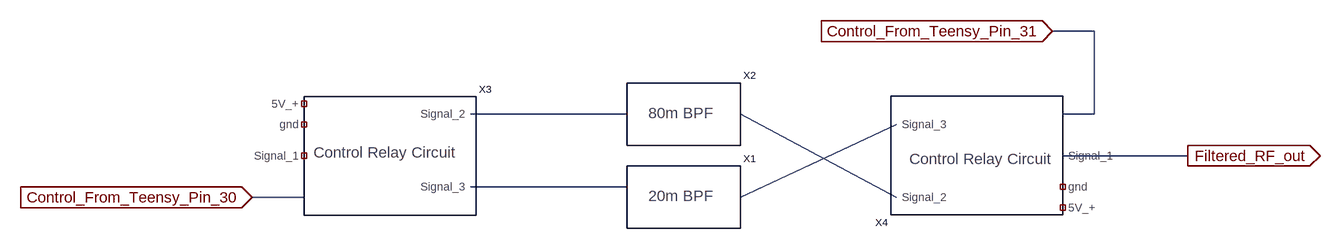
[diagram p0: schematic 80m_20m BPFs.asc]
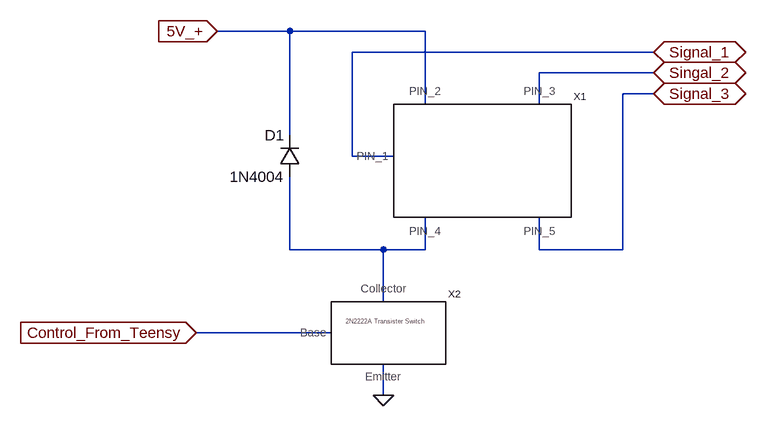
[diagram p1: sub-circuit relay_with_control.asc]
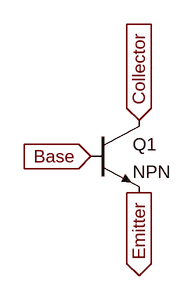
[diagram p2: sub-circuit transistor_switch_(poweramp_for_teensy_to_relay).asc]
80m_20m BPFs.asc, the LTspice schematic file:
Version 4
SHEET 1 1088 680
WIRE 704 -32 640 -32
WIRE -16 96 -256 96
WIRE 704 96 704 -32
WIRE 704 96 656 96
WIRE 848 160 656 160
WIRE -16 208 -256 208
WIRE -512 224 -592 224
WIRE 160 224 400 112
WIRE 400 224 160 96
FLAG -592 224 Control_From_Teensy_Pin_30
IOPIN -592 224 In
FLAG 848 160 Filtered_RF_out
IOPIN 848 160 Out
FLAG 640 -32 Control_From_Teensy_Pin_31
IOPIN 640 -32 In
SYMBOL Final\ SDR\ schematics\ for\ SDD\ 4_28_19\\20m\ BP 112 240 R0
SYMATTR InstName X1
SYMBOL Final\ SDR\ schematics\ for\ SDD\ 4_28_19\\80m\ BP 112 112 R0
SYMATTR InstName X2
SYMBOL Final\ SDR\ schematics\ for\ SDD\ 4_28_19\\Relay_With_Control -368 160 R0
SYMATTR InstName X3
SYMBOL Final\ SDR\ schematics\ for\ SDD\ 4_28_19\\Relay_With_Control 512 160 R180
SYMATTR InstName X4

relay_with_control.asc, the sub-circuit schematic file:
Version 4
SHEET 1 880 680
WIRE -64 -16 -176 -16
WIRE 144 -16 -64 -16
WIRE 496 16 32 16
WIRE 496 48 320 48
WIRE 496 80 448 80
WIRE 144 96 144 -16
WIRE 320 96 320 48
WIRE -64 144 -64 -16
WIRE 32 176 32 16
WIRE 96 176 32 176
WIRE -64 320 -64 208
WIRE 80 320 -64 320
WIRE 144 320 144 272
WIRE 144 320 80 320
WIRE 320 320 320 272
WIRE 448 320 448 80
WIRE 448 320 320 320
WIRE 80 400 80 320
WIRE 0 448 -208 448
WIRE 80 544 80 496
FLAG -176 -16 5V_+
IOPIN -176 -16 In
FLAG -208 448 Control_From_Teensy
IOPIN -208 448 In
FLAG 496 16 Signal_1
IOPIN 496 16 BiDir
FLAG 496 48 Singal_2
IOPIN 496 48 BiDir
FLAG 496 80 Signal_3
IOPIN 496 80 BiDir
FLAG 80 544 0
SYMBOL Relay 272 224 R0
SYMATTR InstName X1
SYMBOL Transistor_switch_(powerAMP_for_Teensy_to_relay) 64 448 R0
SYMATTR InstName X2
SYMBOL diode -48 208 R180
WINDOW 0 24 64 Left 2
WINDOW 3 24 0 Left 2
SYMATTR InstName D1
SYMATTR Value 1N4004

transistor_switch_(poweramp_for_teensy_to_relay).asc, the sub-circuit schematic file:
Version 4
SHEET 1 880 680
FLAG 128 144 Base
IOPIN 128 144 In
FLAG 192 192 Emitter
IOPIN 192 192 Out
FLAG 192 96 Collector
IOPIN 192 96 In
SYMBOL npn 128 96 R0
SYMATTR InstName Q1

The netlist it stands for:
* 80m_20m BPFs.asc
XX1 20m BP
XX2 80m BP
XX3 NC_01 NC_02 Control_From_Teensy_Pin_30 NC_03 N001 N002 relay_with_control
XX4 NC_04 NC_05 Control_From_Teensy_Pin_31 Filtered_RF_out N004 N003 relay_with_control

* block symbol definitions
.subckt relay_with_control 5V_+ gnd  Signal_1 Signal_2 Signal_3
XX1 Signal_1 5V_+ Singal_2 N001 Signal_3 Relay  ; pins PIN_1 PIN_2 PIN_3 PIN_4 PIN_5
XX2 Control_From_Teensy N001 0 transistor_switch_(poweramp_for_teensy_to_relay)
D1 N001 5V_+ 1N4004
.ends relay_with_control

.subckt transistor_switch_(poweramp_for_teensy_to_relay) Base Collector Emitter
Q1 Collector Base Emitter 0 NPN
.ends transistor_switch_(poweramp_for_teensy_to_relay)

.model D D
.lib standard.dio
.model NPN NPN
.model PNP PNP
.lib standard.bjt
.backanno
.end